# Altium schematic sheet DIO_MCX.schdoc: DIO MCX 16
size 420 x 297 mm; EDA_Number: ARTIQ; Projet: ARTIQ/SINARA Kasli Subsystem; Author: G.Kasprowicz; CompanyName: WUT ISE; DrawnBy: G.Kasprowicz; Organization: WUT ISE; Address1: PW ISE; Address2: Nowowiejska 15/19 00-665 Warsaw; Address3: gkasprow@gmail.com; DocumentNumber: 2; Revision: 2; SheetNumber: 2; SheetTotal: 7; ModifiedBy: -; CheckedDate: -; Title2: Baseboard Top; DivGrp: WUT ISE; Designer: G.Kasprowicz; ModifiedDate: -; ProjectName: Sensor Box
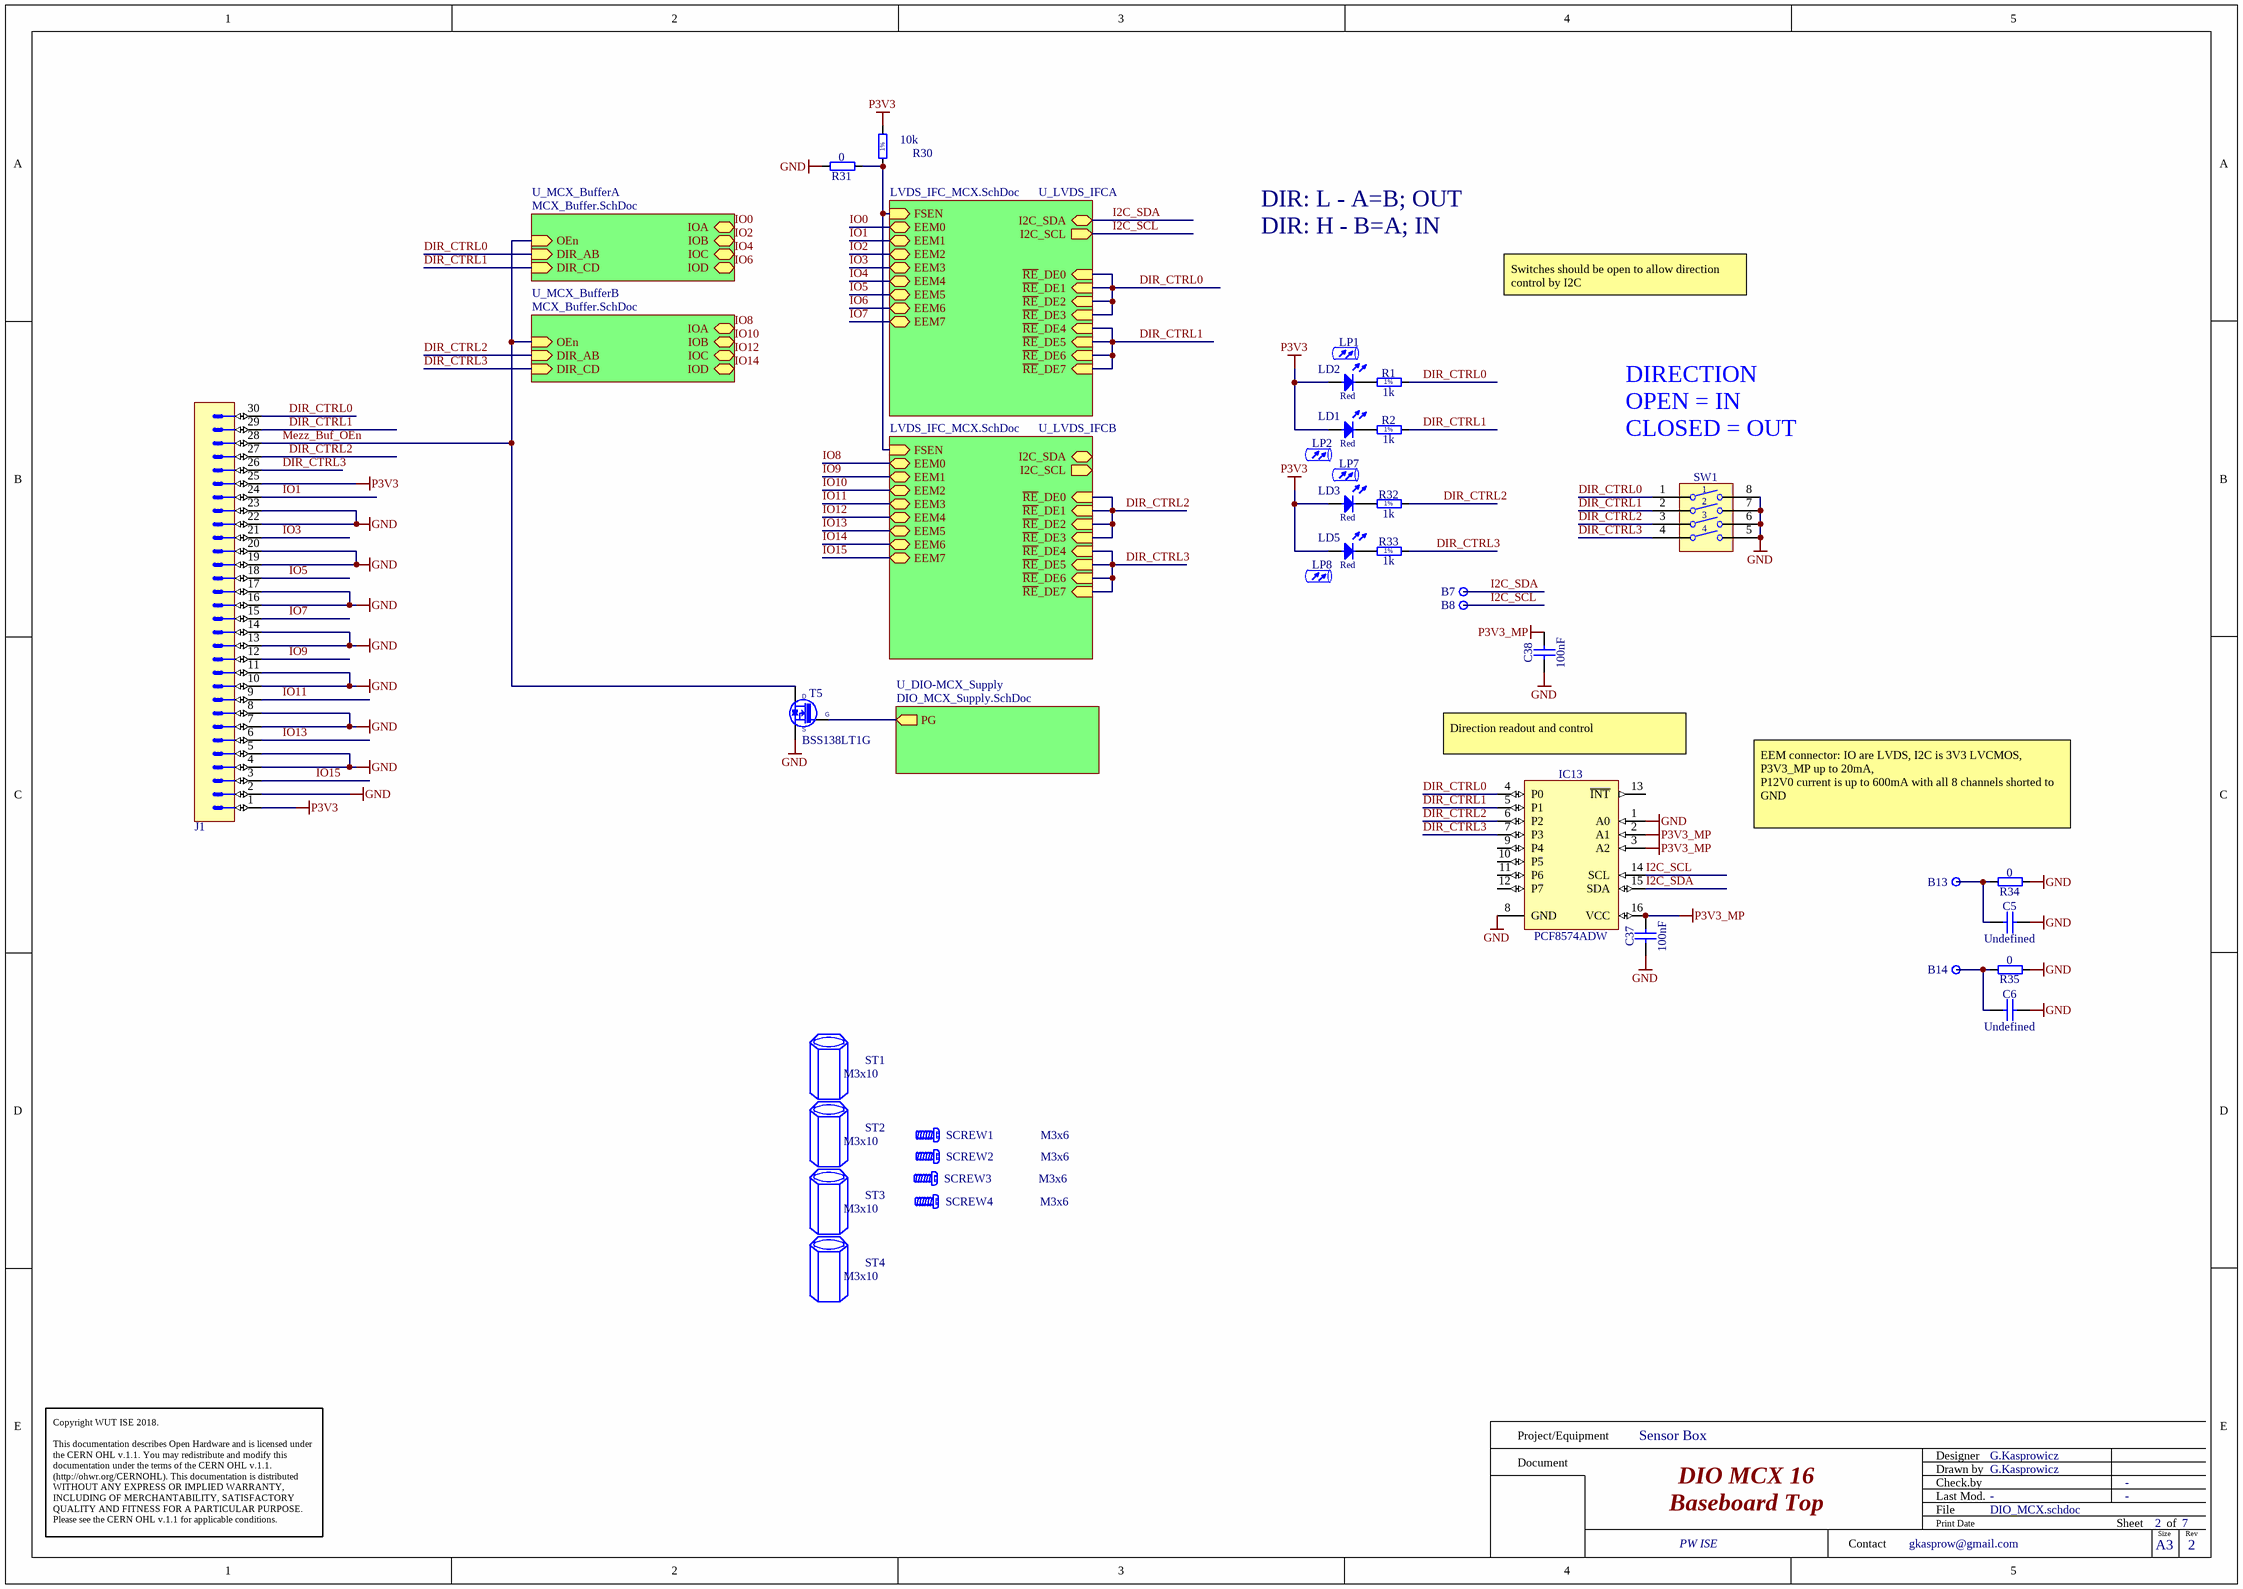
[diagram p0: DIO_MCX.schdoc]

## Parts
B7  Plated Hole  [c130h60]  (value not drawn)
B8  Plated Hole  [c130h60]  (value not drawn)
B13  Plated Hole  [MTG270_500]  (value not drawn)
B14  Plated Hole  [MTG270_500]  (value not drawn)
C5  Undefined  [CAPC2012X135N]
C6  Undefined  [CAPC2012X135N]
C37  100nF  [CAPC1005X55N]
C38  100nF  [CAPC1005X55N]
IC13  PCF8574ADW  [SOIC127P1030X265-16N]
J1  (no value)  [3M_N2530-6002RB]
LD1  Red  [LED_DIALIGHT_551-1107F]
LD2  Red  [LED_DIALIGHT_551-1107F]
LD3  Red  [LED_DIALIGHT_551-1107F]
LD5  Red  [LED_DIALIGHT_551-1107F]
LP1  (no value)  [FIX&FASTEN-LEMB2-8V0-F]
LP2  (no value)  [FIX&FASTEN-LEMB2-8V0-F]
LP7  (no value)  [FIX&FASTEN-LEMB2-8V0-F]
LP8  (no value)  [FIX&FASTEN-LEMB2-8V0-F]
R1  1k  [RESC1005X40N]
R2  1k  [RESC1005X40N]
R30  10k  [RESC1005X40N]
R31  0  [RESC1608X55N]
R32  1k  [RESC1005X40N]
R33  1k  [RESC1005X40N]
R34  0  [RESC1608X55N]
R35  0  [RESC1608X55N]
SCREW1  M3x6  [BOSSARD_BN5687-3061605_v]
SCREW2  M3x6  [BOSSARD_BN5687-3061605_v]
SCREW3  M3x6  [BOSSARD_BN5687-3061605_v]
SCREW4  M3x6  [BOSSARD_BN5687-3061605_v]
ST1  M3x10  [HARWIN_R25-1001002]
ST2  M3x10  [HARWIN_R25-1001002]
ST3  M3x10  [HARWIN_R25-1001002]
ST4  M3x10  [HARWIN_R25-1001002]
SW1  Switch  [SW_OMRON_A6S-4102-H]  (value not drawn)
T5  BSS138LT1G  [SOT95P240X110-3N]

## Sub-sheets
U_DIO-MCX_Supply = DIO_MCX_Supply.SchDoc: PG (out)
U_LVDS_IFCA = LVDS_IFC_MCX.SchDoc: ~{RE}_DE1 (in), ~{RE}_DE2 (in), ~{RE}_DE3 (in), ~{RE}_DE4 (in), ~{RE}_DE5 (in), ~{RE}_DE6 (in), ~{RE}_DE7 (in), ~{RE}_DE0 (in), I2C_SDA (bidir), I2C_SCL (out), EEM1 (bidir), EEM2 (bidir), EEM5 (bidir), EEM6 (bidir), EEM7 (bidir), EEM3 (bidir), EEM4 (bidir), EEM0 (bidir), FSEN (in)
U_LVDS_IFCB = LVDS_IFC_MCX.SchDoc: I2C_SDA (bidir), I2C_SCL (out), EEM1 (bidir), EEM2 (bidir), EEM5 (bidir), EEM6 (bidir), EEM7 (bidir), EEM3 (bidir), EEM4 (bidir), EEM0 (bidir), ~{RE}_DE1 (in), ~{RE}_DE2 (in), ~{RE}_DE3 (in), ~{RE}_DE4 (in), ~{RE}_DE5 (in), ~{RE}_DE6 (in), ~{RE}_DE7 (in), ~{RE}_DE0 (in), FSEN (in)
U_MCX_BufferA = MCX_Buffer.SchDoc: IOA (bidir), IOB (bidir), IOC (bidir), IOD (bidir), DIR_AB (in), OEn (in), DIR_CD (in)
U_MCX_BufferB = MCX_Buffer.SchDoc: OEn (in), DIR_AB (in), DIR_CD (in), IOA (bidir), IOB (bidir), IOC (bidir), IOD (bidir)

## Nets
GND: C5.2 C6.2 C37.1 C38.1 IC13.1(A0) IC13.8(GND) J1.2 J1.4 J1.5 J1.7 J1.8 J1.10 J1.11 J1.13 J1.14 J1.16 J1.17 J1.19 J1.20 J1.22 J1.23 R31.2 R34.1 R35.1 SW1.5 SW1.6 SW1.7 SW1.8 T5.2(S)
P3V3: J1.1 J1.25 LD1.2(A) LD2.2(A) LD3.2(A) LD5.2(A) R30.2
P3V3_MP: C37.2 C38.2 IC13.2(A1) IC13.3(A2) IC13.16(VCC)
DIR_CTRL0: IC13.4(P0) J1.30 R1.2 SW1.1 ; sheet U_LVDS_IFCA/~{RE}_DE1, sheet U_LVDS_IFCA/~{RE}_DE2, sheet U_LVDS_IFCA/~{RE}_DE3, sheet U_LVDS_IFCA/~{RE}_DE0, sheet U_MCX_BufferA/DIR_AB
DIR_CTRL1: IC13.5(P1) J1.29 R2.2 SW1.2 ; sheet U_LVDS_IFCA/~{RE}_DE4, sheet U_LVDS_IFCA/~{RE}_DE5, sheet U_LVDS_IFCA/~{RE}_DE6, sheet U_LVDS_IFCA/~{RE}_DE7, sheet U_MCX_BufferA/DIR_CD
DIR_CTRL2: IC13.6(P2) J1.27 R32.2 SW1.3 ; sheet U_LVDS_IFCB/~{RE}_DE1, sheet U_LVDS_IFCB/~{RE}_DE2, sheet U_LVDS_IFCB/~{RE}_DE3, sheet U_LVDS_IFCB/~{RE}_DE0, sheet U_MCX_BufferB/DIR_AB
DIR_CTRL3: IC13.7(P3) J1.26 R33.2 SW1.4 ; sheet U_LVDS_IFCB/~{RE}_DE4, sheet U_LVDS_IFCB/~{RE}_DE5, sheet U_LVDS_IFCB/~{RE}_DE6, sheet U_LVDS_IFCB/~{RE}_DE7, sheet U_MCX_BufferB/DIR_CD
I2C_SCL: B8.1 IC13.14(SCL) ; sheet U_LVDS_IFCA/I2C_SCL
I2C_SDA: B7.1 IC13.15(SDA) ; sheet U_LVDS_IFCA/I2C_SDA
IO0: sheet U_LVDS_IFCA/EEM0, sheet U_MCX_BufferA/IOA
IO1: J1.24 ; sheet U_LVDS_IFCA/EEM1
IO2: sheet U_LVDS_IFCA/EEM2, sheet U_MCX_BufferA/IOB
IO3: J1.21 ; sheet U_LVDS_IFCA/EEM3
IO4: sheet U_LVDS_IFCA/EEM4, sheet U_MCX_BufferA/IOC
IO5: J1.18 ; sheet U_LVDS_IFCA/EEM5
IO6: sheet U_LVDS_IFCA/EEM6, sheet U_MCX_BufferA/IOD
IO7: J1.15 ; sheet U_LVDS_IFCA/EEM7
IO8: sheet U_LVDS_IFCB/EEM0, sheet U_MCX_BufferB/IOA
IO9: J1.12 ; sheet U_LVDS_IFCB/EEM1
IO10: sheet U_LVDS_IFCB/EEM2, sheet U_MCX_BufferB/IOB
IO11: J1.9 ; sheet U_LVDS_IFCB/EEM3
IO12: sheet U_LVDS_IFCB/EEM4, sheet U_MCX_BufferB/IOC
IO13: J1.6 ; sheet U_LVDS_IFCB/EEM5
IO14: sheet U_LVDS_IFCB/EEM6, sheet U_MCX_BufferB/IOD
IO15: J1.3 ; sheet U_LVDS_IFCB/EEM7
Mezz_Buf_OEn: J1.28 T5.3(D) ; sheet U_MCX_BufferA/OEn, sheet U_MCX_BufferB/OEn
NetB13_1: B13.1 C5.1 R34.2
NetB14_1: B14.1 C6.1 R35.2
NetLD1_1: LD1.1(C) R2.1
NetLD2_1: LD2.1(C) R1.1
NetLD3_1: LD3.1(C) R32.1
NetLD5_1: LD5.1(C) R33.1
NetR30_1: R30.1 R31.1 ; sheet U_LVDS_IFCA/FSEN, sheet U_LVDS_IFCB/FSEN
NetT5_1: T5.1(G) ; sheet U_DIO-MCX_Supply/PG

Not connected (* = marked no-connect by the designer): IC13 9(P4) 10(P5) 11(P6) 12(P7) 13(~{INT})

## Notes on the sheet
- DIR: L - A=B; OUT
- DIR: H - B=A; IN
- Switches should be open to allow direction control by I2C
- DIRECTION
- OPEN = IN
- CLOSED = OUT
- Direction readout and control
- EEM connector: IO are LVDS, I2C is 3V3 LVCMOS, P3V3_MP up to 20mA,
  P12V0 current is up to 600mA with all 8 channels shorted to GND
- Project/Equipment
- Document
- Designer
- Drawn by
- Check.by
- Copyright WUT ISE 2018.
  This documentation describes Open Hardware and is licensed under the CERN OHL v.1.1. You may redistribute and modify this documentation under the terms of the CERN OHL v.1.1. (http://ohwr.org/CERNOHL). This documentation is distributed WITHOUT ANY EXPRESS OR IMPLIED WARRANTY, INCLUDING OF MERCHANTABILITY, SATISFACTORY QUALITY AND FITNESS FOR A PARTICULAR PURPOSE. Please see the CERN OHL v.1.1 for applicable conditions.
- Contact
- File
- Last Mod.
- Print Date
- Sheet
- Size
- A3
- of
- Rev
- (in symbol R0402_1K_1%_0.0625W_100PPM) 1%
- (in symbol R0402_10K_1%_0.0625W_100PPM) 1%

## Library data of the parts
B7 B8 = PLATED_HOLE0.6_PAD1.3: Single Terminal Socket; Part Description: Plated Through Hole: Hole Dia.=0.6mm Pad Dia.=1.3mm; Mounted: No; Part Number: PLATED_HOLE0.6_PAD1.3; Component Kind: Standard (No BOM); Component Type: Standard (No BOM); Pin Count: 1; Family: Plated Hole; Socket: No; SMD: No; Sense: No; Status: None; ComponentHeight: 0mm; HelpURL: Undefined; Author: CERN DEM MR; CreateDate: 02.03.2016; LatestRevisionDate: 02.03.2016; PackageDescription: Plated Through Hole: Hole Dia.=0.6mm Pad Dia.=1.3mm
B13 B14 = PLATED_HOLE2.7_PAD5.0: Single Terminal Socket; Part Description: Plated Through Hole: Hole Dia.=2.7mm Pad Dia.=5.0mm; Mounted: No; Part Number: PLATED_HOLE2.7_PAD5.0; Component Kind: Standard (No BOM); Component Type: Standard (No BOM); Pin Count: 1; Family: Plated Hole; Socket: No; SMD: No; Sense: No; Status: None; ComponentHeight: 0mm; HelpURL: Undefined; Author: CERN DEM JMW; CreateDate: 27.09.2011; LatestRevisionDate: 27.09.2011; PackageDescription: Plated Through Hole: Hole Dia.=2.7mm Pad Dia.=5.0mm
C5 C6 = CC0805_NO-VALUE: Non-polarised capacitor; Part Description: Reserved Footprint For 0805(2012) Chip Ceramic Capacitor; Mounted: No; Part Number: CC0805_NO-VALUE; Component Kind: Standard; Component Type: Standard; Pin Count: 2; Value: Undefined; Status: None; Manufacturer: Undefined; Manufacturer Part Number: CC0805_NO-VALUE; Case: 0805; Socket: No; SMD: Yes; Sense: No; Manufacturer1 ComponentHeight: 1.35mm; HelpURL: Undefined; Author: CERN DEM JLC; CreateDate: 10.12.2008; LatestRevisionDate: 11.09.2013
C37 C38 = CC0402_100NF_16V_10%_X5R: Non-polarised capacitor; Part Description: SMD Multilayer Chip Ceramic Capacitor; Manufacturer: GENERIC; Manufacturer1 Part Number: GRM155R61C104KA88D; Voltage: 16V; TC: X5R; Tolerance: ±10%; Part Number: CC0402_100NF_16V_10%_X5R; Component Kind: Standard; Component Type: Standard; Pin Count: 2; Value: 100nF; Status: None; Manufacturer Part Number: CC0402_100NF_16V_10%_X5R; Case: 0402; Mounted: Yes; Socket: No; SMD: Yes; Sense: No; Manufacturer1 Example: MURATA; Manufacturer1 ComponentHeight: 0.55mm; HelpURL: \\cern.ch\dfs\Applications\Altium\Datasheets\CC0402_X5R_MURATA_GRM.pdf; Author: CERN DEM JLC; CreateDate: 10.12.2013; LatestRevisionDate: 10.12.2013
IC13 = PCF8574ADW: Remote 8-bit I/O Expander For I2C Bus; Manufacturer: TEXAS INSTRUMENTS; PressFit: No; Bonding: No; Part Number: PCF8574ADW; Component Kind: Standard; Component Type: Standard; Device: PCF8574ADW; PackageDescription: SOIC 16, Pitch 1.27mm - Body 7.5x10.3mm, IPC Medium Density; Part Description: Remote 8-bit I/O Expander For I2C Bus; Manufacturer Part Number: PCF8574ADW; Pin Count: 16; Case: SOIC16W; Mounted: Yes; Socket: No; SMD: Yes; Sense: No; ComponentHeight: 2.65mm; Author: CERN DEM JLC; HelpURL: \\cern.ch\dfs\Applications\Altium\Datasheets\PCF8574ADW.pdf; CreateDate: 01.11.2012; LatestRevisionDate: 01.11.2012
J1 = 3M_N2530-6002RB: Connector 30 Male; Part Description: 30 Contacts - Straight .100'' x .100'' Low Profile Four-Wall Header, 2500 Series; Manufacturer: 3M; PressFit: No; Part Number: 3M_N2530-6002RB; Component Kind: Standard; Component Type: Standard; Pin Count: 30; Family: Header 30; Mounted: Yes; Socket: No; SMD: No; Sense: No; Status: None; Manufacturer Part Number: N2530-6002RB; ComponentHeight: 10.03mm; HelpURL: \\cern.ch\dfs\Applications\Altium\Datasheets\3M_N2530-6002RB.pdf; Author: CERN DEM JLC; CreateDate: 11.02.2009; LatestRevisionDate: 11.08.2009
LD1-LD3 LD5 = LED_DIALIGHT_551-1107F: LED Red 1C 2A; Part Description: Single 3mm Red LED CBI® Circuit Board Indicator; PressFit: No; Bonding: No; Part Number: LED_DIALIGHT_551-1107F; Component Kind: Standard; Component Type: Standard; Color: Red; PackageDescription: Single 3mm Red LED, Body 6.35x4.32mm, Pin spacing 2.54mm; Manufacturer: DIALIGHT; Manufacturer Part Number: 551-1107F; Pin Count: 2; Mounted: Yes; Socket: No; SMD: No; Sense: No; ComponentHeight: 7.11mm; HelpURL: \\cern.ch\dfs\Applications\Altium\Datasheets\LED_DIALIGHT_551-1107F.pdf; Author: CERN DEM JLC; CreateDate: 13.01.2009; LatestRevisionDate: 17.03.2010
LP1 LP2 LP7 LP8 = LED Light_pipe_2.3x8mm: Part Description: Right Angle Single Element 2.3x8mm Round Lightpipe; Manufacturer: FIX&FASTEN; Manufacturer Part Number: FIX-LEMB2-8V0-F; PressFit: No; Bonding: No; Part Number: FIX&FASTEN-LEMB2-8V0-F; Component Kind: Accessories; Component Type: Standard; PackageDescription: Right Angle Single Element 2.3mmx8mm Round Lightpipe; Pin Count: 0; Mounted: Yes; Socket: No; SMD: No; Sense: No; ComponentHeight: 2.3mm; HelpURL: \\cern.ch\dfs\Applications\Altium\Datasheets\LEDLP_DIALIGHT_515-1049F.pdf; Author: GK; CreateDate: 24.01.2017; LatestRevisionDate: 24.01.2017
R1 R2 R32 R33 = R0402_1K_1%_0.0625W_100PPM: Resistor - 1%; Part Description: General Purpose Thick Film Chip Resistor; Manufacturer: GENERIC; Manufacturer1 Part Number: 232270671002L; TC: ±100ppm/°C; PressFit: No; Part Number: R0402_1K_1%_0.0625W_100PPM; Component Kind: Standard; Component Type: Standard; Pin Count: 2; Value: 1k; Status: Not Recommended; Power: 0.0625W; Tolerance: ±1%; Manufacturer Part Number: R0402_1K_1%_0.0625W_100PPM; Case: 0402; Mounted: Yes; Sense: No; Socket: No; SMD: Yes; Manufacturer1 Example: YAGEO PHYCOMP; Manufacturer1 ComponentHeight: 0.4mm; HelpURL: \\cern.ch\dfs\Applications\Altium\Datasheets\R0402_Phycomp_RC0402.pdf; Author: CERN DEM JLC; CreateDate: 03.12.2007; LatestRevisionDate: 17.10.2012
R30 = R0402_10K_1%_0.0625W_100PPM: Resistor - 1%; Part Description: General Purpose Thick Film Chip Resistor; Manufacturer: GENERIC; Manufacturer1 Part Number: 232270671003L; TC: ±100ppm/°C; Part Number: R0402_10K_1%_0.0625W_100PPM; Component Kind: Standard; Component Type: Standard; Pin Count: 2; Value: 10k; Status: Not recommended; Power: 0.0625W; Tolerance: ±1%; Manufacturer Part Number: R0402_10K_1%_0.0625W_100PPM; Case: 0402; Mounted: Yes; Sense: No; Socket: No; SMD: Yes; Manufacturer1 Example: YAGEO PHYCOMP; Manufacturer1 ComponentHeight: 0.4mm; HelpURL: \\cern.ch\dfs\Applications\Altium\Datasheets\R0402_Phycomp_RC0402.pdf; Author: CERN DEM JLC; CreateDate: 03.12.2007; LatestRevisionDate: 17.10.2012
R31 R34 R35 = R0603_0R_JUMPER: Resistor; Part Description: 1A (0.05R Max DC Resistance) Zero Ohm Jumper; Manufacturer: GENERIC; Manufacturer1 Part Number: NRC06Z0; PressFit: No; Part Number: R0603_0R_JUMPER; Component Kind: Standard; Component Type: Standard; Pin Count: 2; Value: 0; Status: Preferred; Manufacturer Part Number: R0603_0R_JUMPER; Case: 0603; Mounted: Yes; Sense: No; Socket: No; SMD: Yes; Manufacturer1 Example: NIC COMPONENT; Manufacturer1 ComponentHeight: 0.55mm; HelpURL: \\cern.ch\dfs\Applications\Altium\Datasheets\R0603_NIC_NRC.pdf; Author: CERN DEM JLC; CreateDate: 03.12.2007; LatestRevisionDate: 13.03.2008
SCREW1-SCREW4 = BOSSARD_BN5687-3061605_v: Screw; Part Description: M3 L=6mm Hexalobular Socket Pan Head Screw, Fully Threaded, Stainless Steel A2; Manufacturer Part Number: BN5687 Art.3061605; PressFit: No; Part Number: BOSSARD_BN5687-3061605_v; Component Kind: Standard; Component Type: Mechanical; Pin Count: 0; PackageDescription: M3 L=6mm Hexalobular Socket Pan Head Screw, Fully Threaded - Stainless Steel A2; Mounted: Yes; Socket: No; SMD: No; Sense: No; Status: None; Value: M3x6; Manufacturer: BOSSARD; ComponentHeight: 2.4mm; HelpURL: \\cern.ch\dfs\Applications\Altium\Datasheets\BOSSARD_BN5687-3061605.pdf; Author: CERN DEM JLC; CreateDate: 15.01.2013; LatestRevisionDate: 15.01.2013
ST1-ST4 = MECH_Standoff_M3x10: M3x10 standoff; Part Number: DREMEC_TFF-M3X10/DR124; Part Description: M3x10 female Hex Spacer made of free-machining brass with nickel plated finish; Manufacturer: DREMEC; Manufacturer Part Number: TFF-M3X10/DR124; PressFit: No; Component Kind: Standard; Component Type: Mechanical; Footprint: DREMEC_TFF-M3X10/DR124; Pin Count: 0; PackageDescription: M3 L=10mm   Fully Threaded - Stainless Steel spacer; Mounted: Yes; Socket: No; SMD: No; Sense: No; Status: None; Value: M3x10; ComponentHeight: 10mm; HelpURL: \\cern.ch\dfs\Applications\Altium\Datasheets\BOSSARD_BN5687-3061597.pdf; Author: GK; CreateDate: 25.02.2019; LatestRevisionDate: 25.02.2019
SW1 = SW_OMRON_A6S-4102-H: 4 Ways SPST DIP Switch; Part Description: 4 Ways SPST DIP Switch, White Flat Actuator with Seal Tape, Contact Rating 25mA 24VDC; Manufacturer: OMRON; PressFit: No; Part Number: SW_OMRON_A6S-4102-H; Component Kind: Standard; Component Type: Standard; Pin Count: 8; PackageDescription: Pitch 2.54mm, Body 11.3x6.4mm, 4 Ways SPST Surface-Mounting DIP Switch, OMRON A6S-H; Family: Switch; Mounted: Yes; Socket: No; SMD: Yes; Sense: No; Status: None; Manufacturer Part Number: A6S-4102-H; ComponentHeight: 3.8mm; HelpURL: \\cern.ch\dfs\Applications\Altium\Datasheets\SW_OMRON_A6S-4102-H.pdf; Author: CERN DEM JMW; CreateDate: 25.09.2008; LatestRevisionDate: 25.09.2008
T5 = BSS138LT1G: N-CHANNEL MOSFET WITH DIODE; Part Description: 50V 200mA N-Channel Enhancement Mode Field-Effect Transistor; Manufacturer: ON SEMICONDUCTOR; PressFit: No; Bonding: No; Part Number: BSS138LT1G; Component Kind: Standard; Component Type: Standard; Device: BSS138LT1G; PackageDescription: SOT23 3-Leads, Pitch 0.95mm - Body 1.4x3mm, IPC Medium Density; Manufacturer Part Number: BSS138LT1G; Pin Count: 3; Case: SOT23-3; Mounted: Yes; Socket: No; SMD: Yes; Sense: No; ComponentHeight: 1.11mm; HelpURL: \\cern.ch\dfs\Applications\Altium\Datasheets\BSS138LT1G.pdf; Author: CERN DEM JLC; CreateDate: 23.03.2009; LatestRevisionDate: 23.03.2009